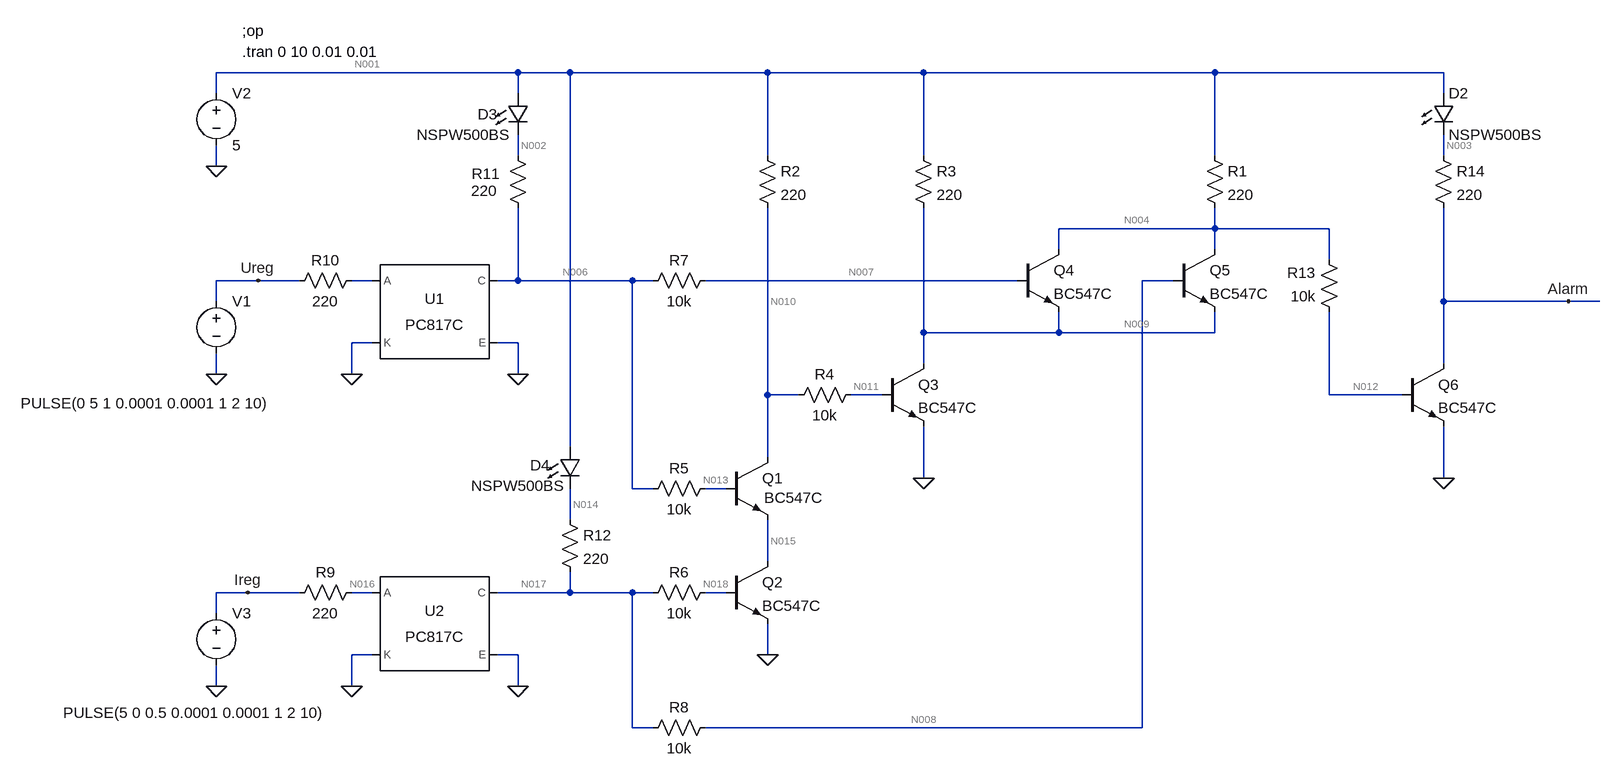
[diagram p0: schematic alarm_concept_XNOR.asc]
alarm_concept_XNOR.asc, the LTspice schematic file:
Version 4
SHEET 1 1332 708
WIRE -336 -368 -800 -368
WIRE -256 -368 -336 -368
WIRE 48 -368 -256 -368
WIRE 288 -368 48 -368
WIRE 736 -368 288 -368
WIRE 1088 -368 736 -368
WIRE -800 -336 -800 -368
WIRE -336 -336 -336 -368
WIRE 1088 -336 1088 -368
WIRE -336 -240 -336 -272
WIRE 48 -240 48 -368
WIRE 288 -240 288 -368
WIRE 736 -240 736 -368
WIRE 1088 -240 1088 -272
WIRE -800 -224 -800 -256
WIRE 736 -128 736 -160
WIRE 736 -128 496 -128
WIRE 912 -128 736 -128
WIRE 496 -96 496 -128
WIRE 736 -96 736 -128
WIRE 912 -80 912 -128
WIRE -736 -48 -800 -48
WIRE -672 -48 -736 -48
WIRE -560 -48 -592 -48
WIRE -336 -48 -336 -160
WIRE -336 -48 -368 -48
WIRE -160 -48 -336 -48
WIRE -128 -48 -160 -48
WIRE 432 -48 -48 -48
WIRE 672 -48 624 -48
WIRE -800 -16 -800 -48
WIRE 1088 -16 1088 -160
WIRE 1280 -16 1088 -16
WIRE 1328 -16 1280 -16
WIRE 288 32 288 -160
WIRE 496 32 496 0
WIRE 496 32 288 32
WIRE 736 32 736 0
WIRE 736 32 496 32
WIRE -560 48 -592 48
WIRE -336 48 -368 48
WIRE 288 80 288 32
WIRE 1088 80 1088 -16
WIRE -800 96 -800 64
WIRE -592 96 -592 48
WIRE -336 96 -336 48
WIRE 48 128 48 -160
WIRE 96 128 48 128
WIRE 224 128 176 128
WIRE 912 128 912 0
WIRE 1024 128 912 128
WIRE -256 208 -256 -368
WIRE 48 224 48 128
WIRE 288 256 288 176
WIRE 1088 256 1088 176
WIRE -160 272 -160 -48
WIRE -128 272 -160 272
WIRE -16 272 -48 272
WIRE -256 320 -256 272
WIRE 48 384 48 320
WIRE -752 432 -800 432
WIRE -672 432 -752 432
WIRE -560 432 -592 432
WIRE -256 432 -256 400
WIRE -256 432 -368 432
WIRE -160 432 -256 432
WIRE -128 432 -160 432
WIRE -16 432 -48 432
WIRE -800 464 -800 432
WIRE -560 528 -592 528
WIRE -336 528 -368 528
WIRE 48 528 48 480
WIRE -800 576 -800 544
WIRE -592 576 -592 528
WIRE -336 576 -336 528
WIRE -160 640 -160 432
WIRE -128 640 -160 640
WIRE 624 640 624 -48
WIRE 624 640 -48 640
FLAG 288 256 0
FLAG 48 528 0
FLAG 1088 256 0
FLAG -800 96 0
FLAG -800 -224 0
FLAG -336 96 0
FLAG -592 96 0
FLAG -592 576 0
FLAG -336 576 0
FLAG -752 432 Ireg
FLAG -736 -48 Ureg
FLAG -800 576 0
FLAG 1280 -16 Alarm
DATAFLAG -336 -96 ""
DATAFLAG -320 432 ""
DATAFLAG 48 128 ""
DATAFLAG 288 32 ""
DATAFLAG 1136 -16 ""
DATAFLAG 912 -128 ""
SYMBOL npn -16 224 R0
WINDOW 3 59 62 Left 2
SYMATTR Value BC547C
SYMATTR InstName Q1
SYMBOL npn -16 384 R0
SYMATTR InstName Q2
SYMATTR Value BC547C
SYMBOL npn 224 80 R0
SYMATTR InstName Q3
SYMATTR Value BC547C
SYMBOL npn 432 -96 R0
SYMATTR InstName Q4
SYMATTR Value BC547C
SYMBOL npn 672 -96 R0
SYMATTR InstName Q5
SYMATTR Value BC547C
SYMBOL res 720 -256 R0
SYMATTR InstName R1
SYMATTR Value 220
SYMBOL res 32 -256 R0
SYMATTR InstName R2
SYMATTR Value 220
SYMBOL res 272 -256 R0
SYMATTR InstName R3
SYMATTR Value 220
SYMBOL res 192 112 R90
WINDOW 0 0 56 VBottom 2
WINDOW 3 32 56 VTop 2
SYMATTR InstName R4
SYMATTR Value 10k
SYMBOL LED 1072 -336 R0
SYMATTR InstName D2
SYMATTR Value NSPW500BS
SYMATTR Description Diode
SYMATTR Type diode
SYMBOL res -32 256 R90
WINDOW 0 0 56 VBottom 2
WINDOW 3 32 56 VTop 2
SYMATTR InstName R5
SYMATTR Value 10k
SYMBOL res -32 416 R90
WINDOW 0 0 56 VBottom 2
WINDOW 3 32 56 VTop 2
SYMATTR InstName R6
SYMATTR Value 10k
SYMBOL res -32 -64 R90
WINDOW 0 0 56 VBottom 2
WINDOW 3 32 56 VTop 2
SYMATTR InstName R7
SYMATTR Value 10k
SYMBOL res -32 624 R90
WINDOW 0 0 56 VBottom 2
WINDOW 3 32 56 VTop 2
SYMATTR InstName R8
SYMATTR Value 10k
SYMBOL voltage -800 -32 R0
WINDOW 123 0 0 Left 0
WINDOW 39 0 0 Left 0
WINDOW 3 -301 173 Left 2
SYMATTR Value PULSE(0 5 1 0.0001 0.0001 1 2 10)
SYMATTR InstName V1
SYMBOL voltage -800 -352 R0
WINDOW 123 0 0 Left 0
WINDOW 39 0 0 Left 0
SYMATTR InstName V2
SYMATTR Value 5
SYMBOL Optos\\PC817C -464 0 R0
SYMATTR InstName U1
SYMBOL Optos\\PC817C -464 480 R0
SYMATTR InstName U2
SYMBOL res -576 416 R90
WINDOW 0 0 56 VBottom 2
WINDOW 3 32 56 VTop 2
SYMATTR InstName R9
SYMATTR Value 220
SYMBOL res -576 -64 R90
WINDOW 0 0 56 VBottom 2
WINDOW 3 32 56 VTop 2
SYMATTR InstName R10
SYMATTR Value 220
SYMBOL voltage -800 448 R0
WINDOW 123 0 0 Left 0
WINDOW 39 0 0 Left 0
WINDOW 3 -236 169 Left 2
SYMATTR Value PULSE(5 0 0.5 0.0001 0.0001 1 2 10)
SYMATTR InstName V3
SYMBOL LED -352 -336 R0
WINDOW 0 -46 32 Left 2
WINDOW 3 -140 64 Left 2
SYMATTR InstName D3
SYMATTR Value NSPW500BS
SYMATTR Description Diode
SYMATTR Type diode
SYMBOL LED -272 208 R0
WINDOW 0 -45 28 Left 2
WINDOW 3 -136 60 Left 2
SYMATTR InstName D4
SYMATTR Value NSPW500BS
SYMATTR Description Diode
SYMATTR Type diode
SYMBOL res -352 -256 R0
WINDOW 0 -55 44 Left 2
WINDOW 3 -56 70 Left 2
SYMATTR InstName R11
SYMATTR Value 220
SYMBOL res -272 304 R0
SYMATTR InstName R12
SYMATTR Value 220
SYMBOL res 928 16 R180
WINDOW 0 36 76 Left 2
WINDOW 3 36 40 Left 2
SYMATTR InstName R13
SYMATTR Value 10k
SYMBOL npn 1024 80 R0
SYMATTR InstName Q6
SYMATTR Value BC547C
SYMBOL res 1072 -256 R0
SYMATTR InstName R14
SYMATTR Value 220
TEXT -760 -432 Left 2 !;op
TEXT -760 -400 Left 2 !.tran 0 10 0.01 0.01

The netlist it stands for:
* alarm_concept_XNOR.asc
Q1 N010 N013 N015 0 BC547C
Q2 N015 N018 0 0 BC547C
Q3 N009 N011 0 0 BC547C
Q4 N004 N007 N009 0 BC547C
Q5 N004 N008 N009 0 BC547C
R1 N001 N004 220
R2 N001 N010 220
R3 N001 N009 220
R4 N011 N010 10k
D2 N001 N003 NSPW500BS
R5 N013 N006 10k
R6 N018 N017 10k
R7 N007 N006 10k
R8 N008 N017 10k
V1 Ureg 0 PULSE(0 5 1 0.0001 0.0001 1 2 10)
V2 N001 0 5
XU1 N005 0 N006 0 PC817 Igain=2.3m  ; PC817C, pins A K C E
XU2 N016 0 N017 0 PC817 Igain=2.3m  ; PC817C, pins A K C E
R9 N016 Ireg 220
R10 N005 Ureg 220
V3 Ireg 0 PULSE(5 0 0.5 0.0001 0.0001 1 2 10)
D3 N001 N002 NSPW500BS
D4 N001 N014 NSPW500BS
R11 N002 N006 220
R12 N014 N017 220
R13 N012 N004 10k
Q6 Alarm N012 0 0 BC547C
R14 N003 Alarm 220
.model D D
.lib standard.dio
.model NPN NPN
.model PNP PNP
.lib standard.bjt
;op
.tran 0 10 0.01 0.01
.lib PC817.sub
.backanno
.end

* Results of the author's LTspice run, read from the files saved beside the schematic
* Operating Point, zero values left out:
*   V(n010) = 4.908 V
*   V(n013) = 2.609 V
*   V(n015) = 2.469 V
*   V(n018) = 134.4 mV
*   V(n009) = 133.7 mV
*   V(n011) = 741.7 mV
*   V(n004) = 240.4 mV
*   V(n007) = 847 mV
*   V(n008) = 134.4 mV
*   V(n001) = 5 V
*   V(n003) = 4.814 V
*   V(n006) = 2.609 V
*   V(n017) = 134.4 mV
*   V(n016) = 1.122 V
*   V(ireg) = 5 V
*   V(n002) = 2.648 V
*   V(n014) = 1.929 V
*   V(n012) = 240.4 mV
*   V(alarm) = 4.814 V
*   Ic(Q6) = 507.9 pA
*   Ib(Q6) = -2.41 pA
*   Ie(Q6) = -505.5 pA
*   Ic(Q4) = 21.63 mA
*   Ib(Q4) = 176.2 µA
*   Ie(Q4) = -21.81 mA
*   Ic(Q3) = 43.93 mA
*   Ib(Q3) = 416.7 µA
*   Ie(Q3) = -44.35 mA
*   Ic(Q2) = 10.73 pA
*   Ib(Q2) = -2.142 pA
*   Ie(Q2) = -8.587 pA
*   Ic(Q1) = 12.81 pA
*   Ib(Q1) = -2.086 pA
*   Ie(Q1) = -10.73 pA
*   I(D4) = 8.158 mA
*   I(D3) = 176.2 µA
*   I(D2) = 507.9 pA
*   I(R14) = 507.9 pA
*   I(R13) = 2.41 pA
*   I(R12) = 8.158 mA
*   I(R11) = 176.2 µA
*   I(R9) = -17.63 mA
*   I(R7) = -176.2 µA
*   I(R6) = 2.142 pA
*   I(R5) = 2.086 pA
*   I(R4) = -416.7 µA
*   I(R3) = 22.12 mA
*   I(R2) = 416.7 µA
*   I(R1) = 21.63 mA
*   I(V3) = -17.63 mA
*   I(V2) = -52.5 mA
*   Ix(u1:3) = 6.85 pA
*   Ix(u1:4) = -6.85 pA
*   Ix(u2:1) = 17.63 mA
*   Ix(u2:2) = -17.63 mA
*   Ix(u2:3) = 8.158 mA
*   Ix(u2:4) = -8.158 mA
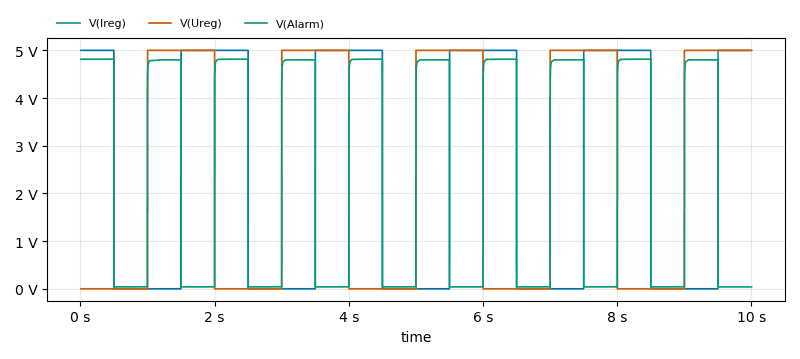
[diagram p1: Transient Analysis of alarm_concept_XNOR.asc, plotted from the saved traces]
* Transient Analysis, 1 run:
*   V(Ireg): min 0 V, max 5 V, average 2.497 V, rms 3.534 V, last 5 V
*   V(Ureg): min 0 V, max 5 V, average 2.503 V, rms 3.537 V, last 5 V
*   V(Alarm): min 39.94 mV, max 4.82 V, average 2.417 V, rms 3.392 V, last 39.95 mV